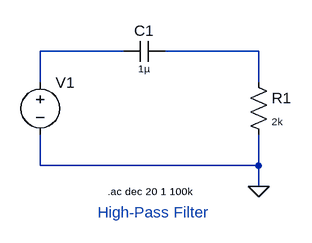
[diagram p0: schematic High_Pass_Filter.asc]
High_Pass_Filter.asc, the LTspice schematic file:
Version 4
SHEET 1 880 680
WIRE 368 272 240 272
WIRE 576 272 432 272
WIRE 240 320 240 272
WIRE 576 320 576 272
WIRE 240 448 240 400
WIRE 576 448 576 400
WIRE 576 448 240 448
WIRE 576 480 576 448
FLAG 576 480 0
SYMBOL Cap 432 256 R90
WINDOW 0 0 32 VBottom 2
WINDOW 3 32 32 VTop 1
SYMATTR InstName C1
SYMATTR Value 1µ
SYMBOL Voltage 240 304 R0
SYMATTR InstName V1
SYMATTR Value ""
SYMATTR Value2 AC 1
SYMBOL Res 560 304 R0
WINDOW 3 36 76 Left 1
SYMATTR InstName R1
SYMATTR Value 2k
TEXT 344 488 Left 1 !.ac dec 20 1 100k
TEXT 328 520 Left 2 ;High-Pass Filter

The netlist it stands for:
* High_Pass_Filter.asc
C1 N002 N001 1µ
V1 N001 0 AC 1
R1 N002 0 2k
.ac dec 20 1 100k
* High-Pass Filter
.backanno
.end